# Altium schematic sheet barra_sec_principal.SchDoc
size A3
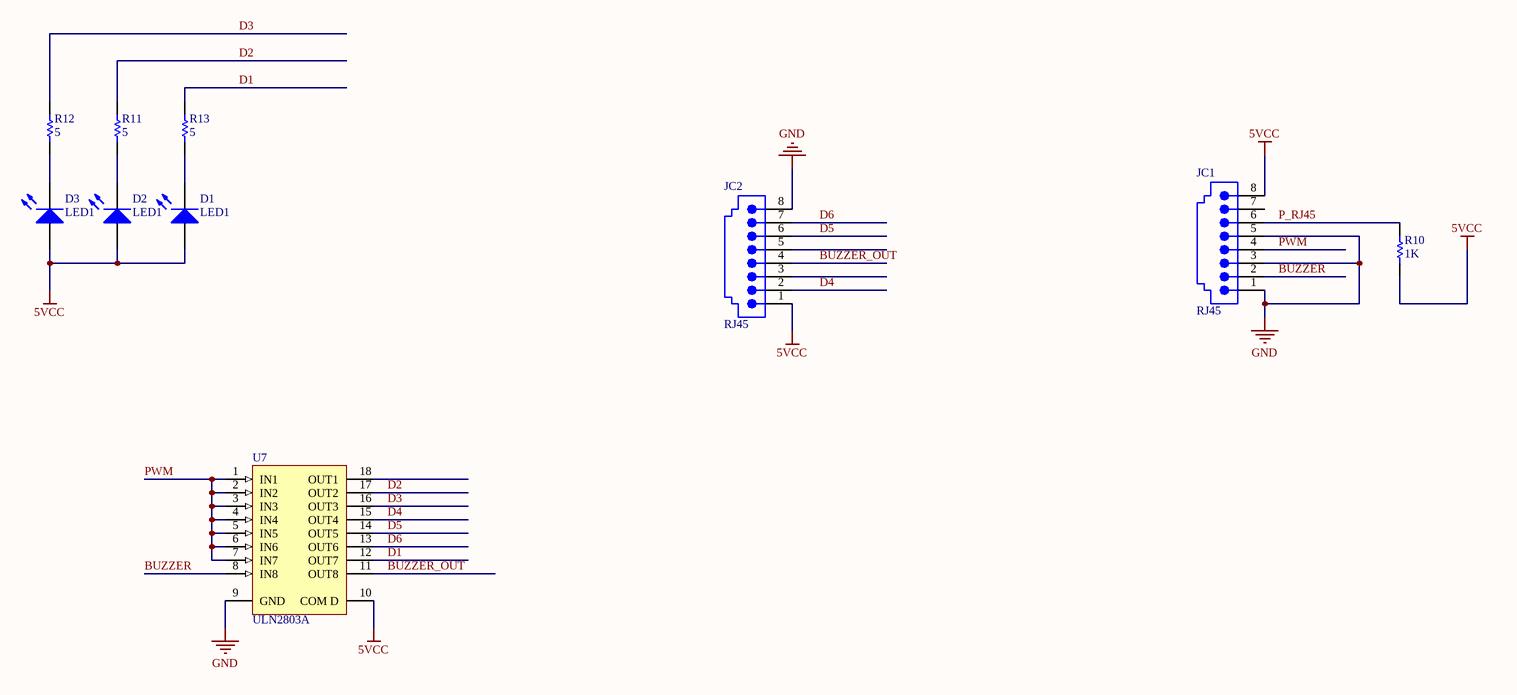
[diagram p0: barra_sec_principal.SchDoc]

## Parts
D1  LED1  [LED5MM RED]
D2  LED1  [LED5MM RED]
D3  LED1  [LED5MM RED]
JC1  RJ45  [15-43-6233]
JC2  RJ45  [15-43-6233]
R10  value 1K  [AXIAL-0.3]  (hidden comment: Res)
R11  value 5  [AXIAL-0.3]  (hidden comment: Res)
R12  value 5  [AXIAL-0.3]  (hidden comment: Res)
R13  value 5  [AXIAL-0.3]  (hidden comment: Res)
U7  ULN2803A  [A18]

## Nets
5VCC: D1.1(A) D2.1(A) D3.1(A) JC1.8 JC2.1 R10.1 U7.10(COM_D)
GND: JC1.1 JC1.3 JC1.5 JC2.8 U7.9(GND)
BUZZER: JC1.2 U7.8(IN8)
BUZZER_OUT: JC2.4 U7.11(OUT8)
D1: R13.2 U7.12(OUT7)
D2: R11.2 U7.17(OUT2)
D3: R12.2 U7.16(OUT3)
D4: JC2.2 U7.15(OUT4)
D5: JC2.6 U7.14(OUT5)
D6: JC2.7 U7.13(OUT6)
P_RJ45: JC1.6 R10.2
PWM: JC1.4 U7.1(IN1) U7.2(IN2) U7.3(IN3) U7.4(IN4) U7.5(IN5) U7.6(IN6) U7.7(IN7)
NetD1_2: D1.2(K) R13.1
NetD2_2: D2.2(K) R11.1
NetD3_2: D3.2(K) R12.1

Not connected (* = marked no-connect by the designer): JC1 7; JC2 3 5; U7 18(OUT1)

## Library data of the parts
D1-D3 = LED1: Typical RED GaAs LED; Published: 8-Jun-2000; LatestRevisionDate: 08-Jul-2005; LatestRevisionNote: Mech Layer 1 removed.; PackageReference: LED-1; Publisher: Altium Limited
JC1 JC2 = 15-43-6233: Right Angle, Standard Profile, RJ45-Keyed, Flange Mount PCB Jack; Ports: 1; Positions/Loaded: Port1 - 8 Keyed/8; PerformanceCategory: 3; PCB_Mounting: Thru-Hole; ComponentAvailability: Obsolete; DrillSize: Nominal, Rounded to nearest 0.05mm; PCB_Layout: Complies with Manufacturer's Recommendation.; Published: 25-Jun-2002; DatasheetDocument: 18-Dec-2001; PackageDocument: 18-Dec-2001; PackageReference: 15-43-6233; Publisher: Altium Limited; ComponentLink1Description: Manufacturer Link; ComponentLink1URL: http://www.molex.com/; ComponentLink2Description: Datasheet; ComponentLink2URL: http://www.molex.com/cmc_upload/common_files/1212003_catalogmx41314.pdf; ComponentLink3Description: Iges Model; ComponentLink3URL: http://www.molex.com/pdm_docs/igs/15-43-6233_igs.zip
R10-R13 = Res1: Resistor; Published: 8-Jun-2000; LatestRevisionDate: 17-Jul-2002; LatestRevisionNote: Re-released for DXP Platform.; PackageReference: AXIAL-0.3; Publisher: Altium Limited
U7 = ULN2803A: High-Voltage, High-Current Darlington Array; Published: 13-Oct-2000; LatestRevisionDate: 06-Jun-2005; LatestRevisionNote: Stylized 3D Model Added.; DatasheetVersion: 1999; PackageVersion: 1999; PackageReference: A18; Publisher: Altium Limited; PackageDescription: DIP; 18 Leads; Row Spacing 7.62 mm; Pitch 2.54 mm; ComponentLink1Description: Manufacturer Link; ComponentLink1URL: http://www.allegromicro.com/